# EAGLE schematic Mainboard (EAGLE 7.5.0)
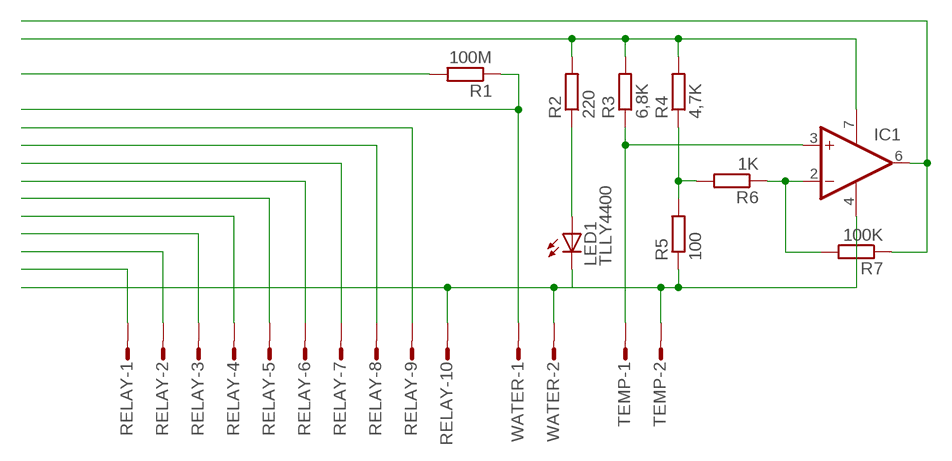
[diagram p0: schematic, sheet 1]

## Parts
IC1  1AMP_P7+4N  [DIL08]
LED1  TLLY4400  [LED3MM]
R1  100M  R-EU_VMTA55  [VMTA55]
R2  220  R-EU_VMTA55  [VMTA55]
R3  6,8K  R-EU_VMTA55  [VMTA55]
R4  4,7K  R-EU_VMTA55  [VMTA55]
R5  100  R-EU_VMTA55  [VMTA55]
R6  1K  R-EU_VMTA55  [VMTA55]
R7  100K  R-EU_VMTA55  [VMTA55]
RELAY  L10P  [L10P]
TEMP  L02P  [L02P]
WATER  L02P  [L02P]

## Nets
N$1: IC1.7(V+) R2.2 R3.2 R4.2
N$2: R1.1 WATER.1
N$3: IC1.4(V-) LED1.K(C) R5.1 RELAY.10 TEMP.2 WATER.2
N$4: R4.1 R5.2 R6.2
N$5: IC1.2(-IN) R6.1 R7.2
N$6: IC1.3(+IN) R3.1 TEMP.1
N$7: IC1.6(OUT) R7.1
N$8: LED1.A R2.1
N$9: R1.2
N$10: RELAY.6
N$11: RELAY.7
N$12: RELAY.8
N$13: RELAY.9
N$16: RELAY.1
N$17: RELAY.2
N$18: RELAY.3
N$19: RELAY.4
N$20: RELAY.5

## Library data of the parts
IC1 = linear:1AMP_P7+4: OP AMP
LED1 = led:TLLY4400: Low Current (2mA) LED 3 mm Tinted Diffused Package color YELLOW Source: Data sheet <http://www.farnell.com/datasheets/391098.pdf>; MF: VISHAY SEMICONDUCTOR; OC_FARNELL: 1612439
R1-R7 = resistor:R-EU_: RESISTOR, European symbol
RELAY = con-amp-mt:L10P: AMP MT CONNECTOR; OC_FARNELL: unknown; OC_NEWARK: unknown
TEMP WATER = con-amp-mt:L02P: AMP MT CONNECTOR; OC_FARNELL: unknown; OC_NEWARK: unknown